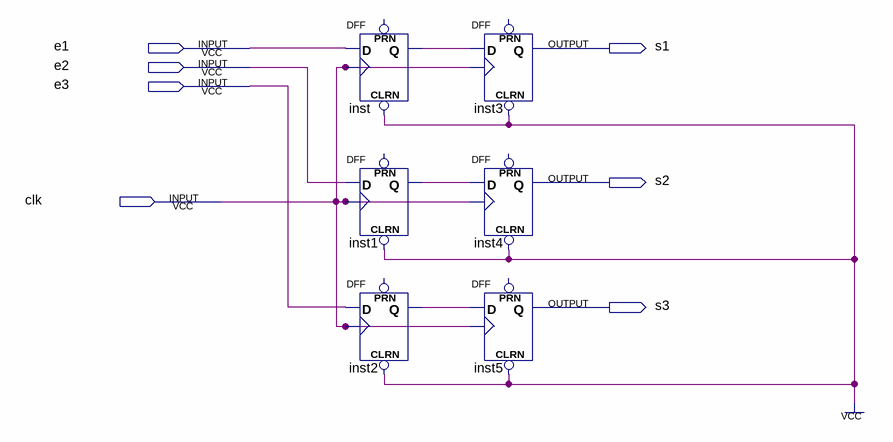
[diagram p0: schematic sheet]
// Quartus schematic sync_signals_buffer.bdf as structural Verilog: 6 symbols, 7 pins
module sync_signals_buffer (
  input  e1,
  input  e2,
  input  e3,
  input  clk,
  output s1,
  output s2,
  output s3
);

  wire inst1_q, inst2_q, inst_q;

  DFF inst (.CLRN(1'b1), .CLK(clk), .D(e1), .Q(inst_q));  // open: PRN
  DFF inst1 (.CLRN(1'b1), .CLK(clk), .D(e2), .Q(inst1_q));  // open: PRN
  DFF inst2 (.CLRN(1'b1), .CLK(clk), .D(e3), .Q(inst2_q));  // open: PRN
  DFF inst3 (.CLRN(1'b1), .CLK(clk), .D(inst_q), .Q(s1));  // open: PRN
  DFF inst4 (.CLRN(1'b1), .CLK(clk), .D(inst1_q), .Q(s2));  // open: PRN
  DFF inst5 (.CLRN(1'b1), .CLK(clk), .D(inst2_q), .Q(s3));  // open: PRN
endmodule
